# Altium project OBCv1.5.PrjPcb (part 2 of 2)

## Sheet POWER_SUPPLY.SchDoc
size 393 x 294 mm; SheetNumber: 4; SheetTotal: 7
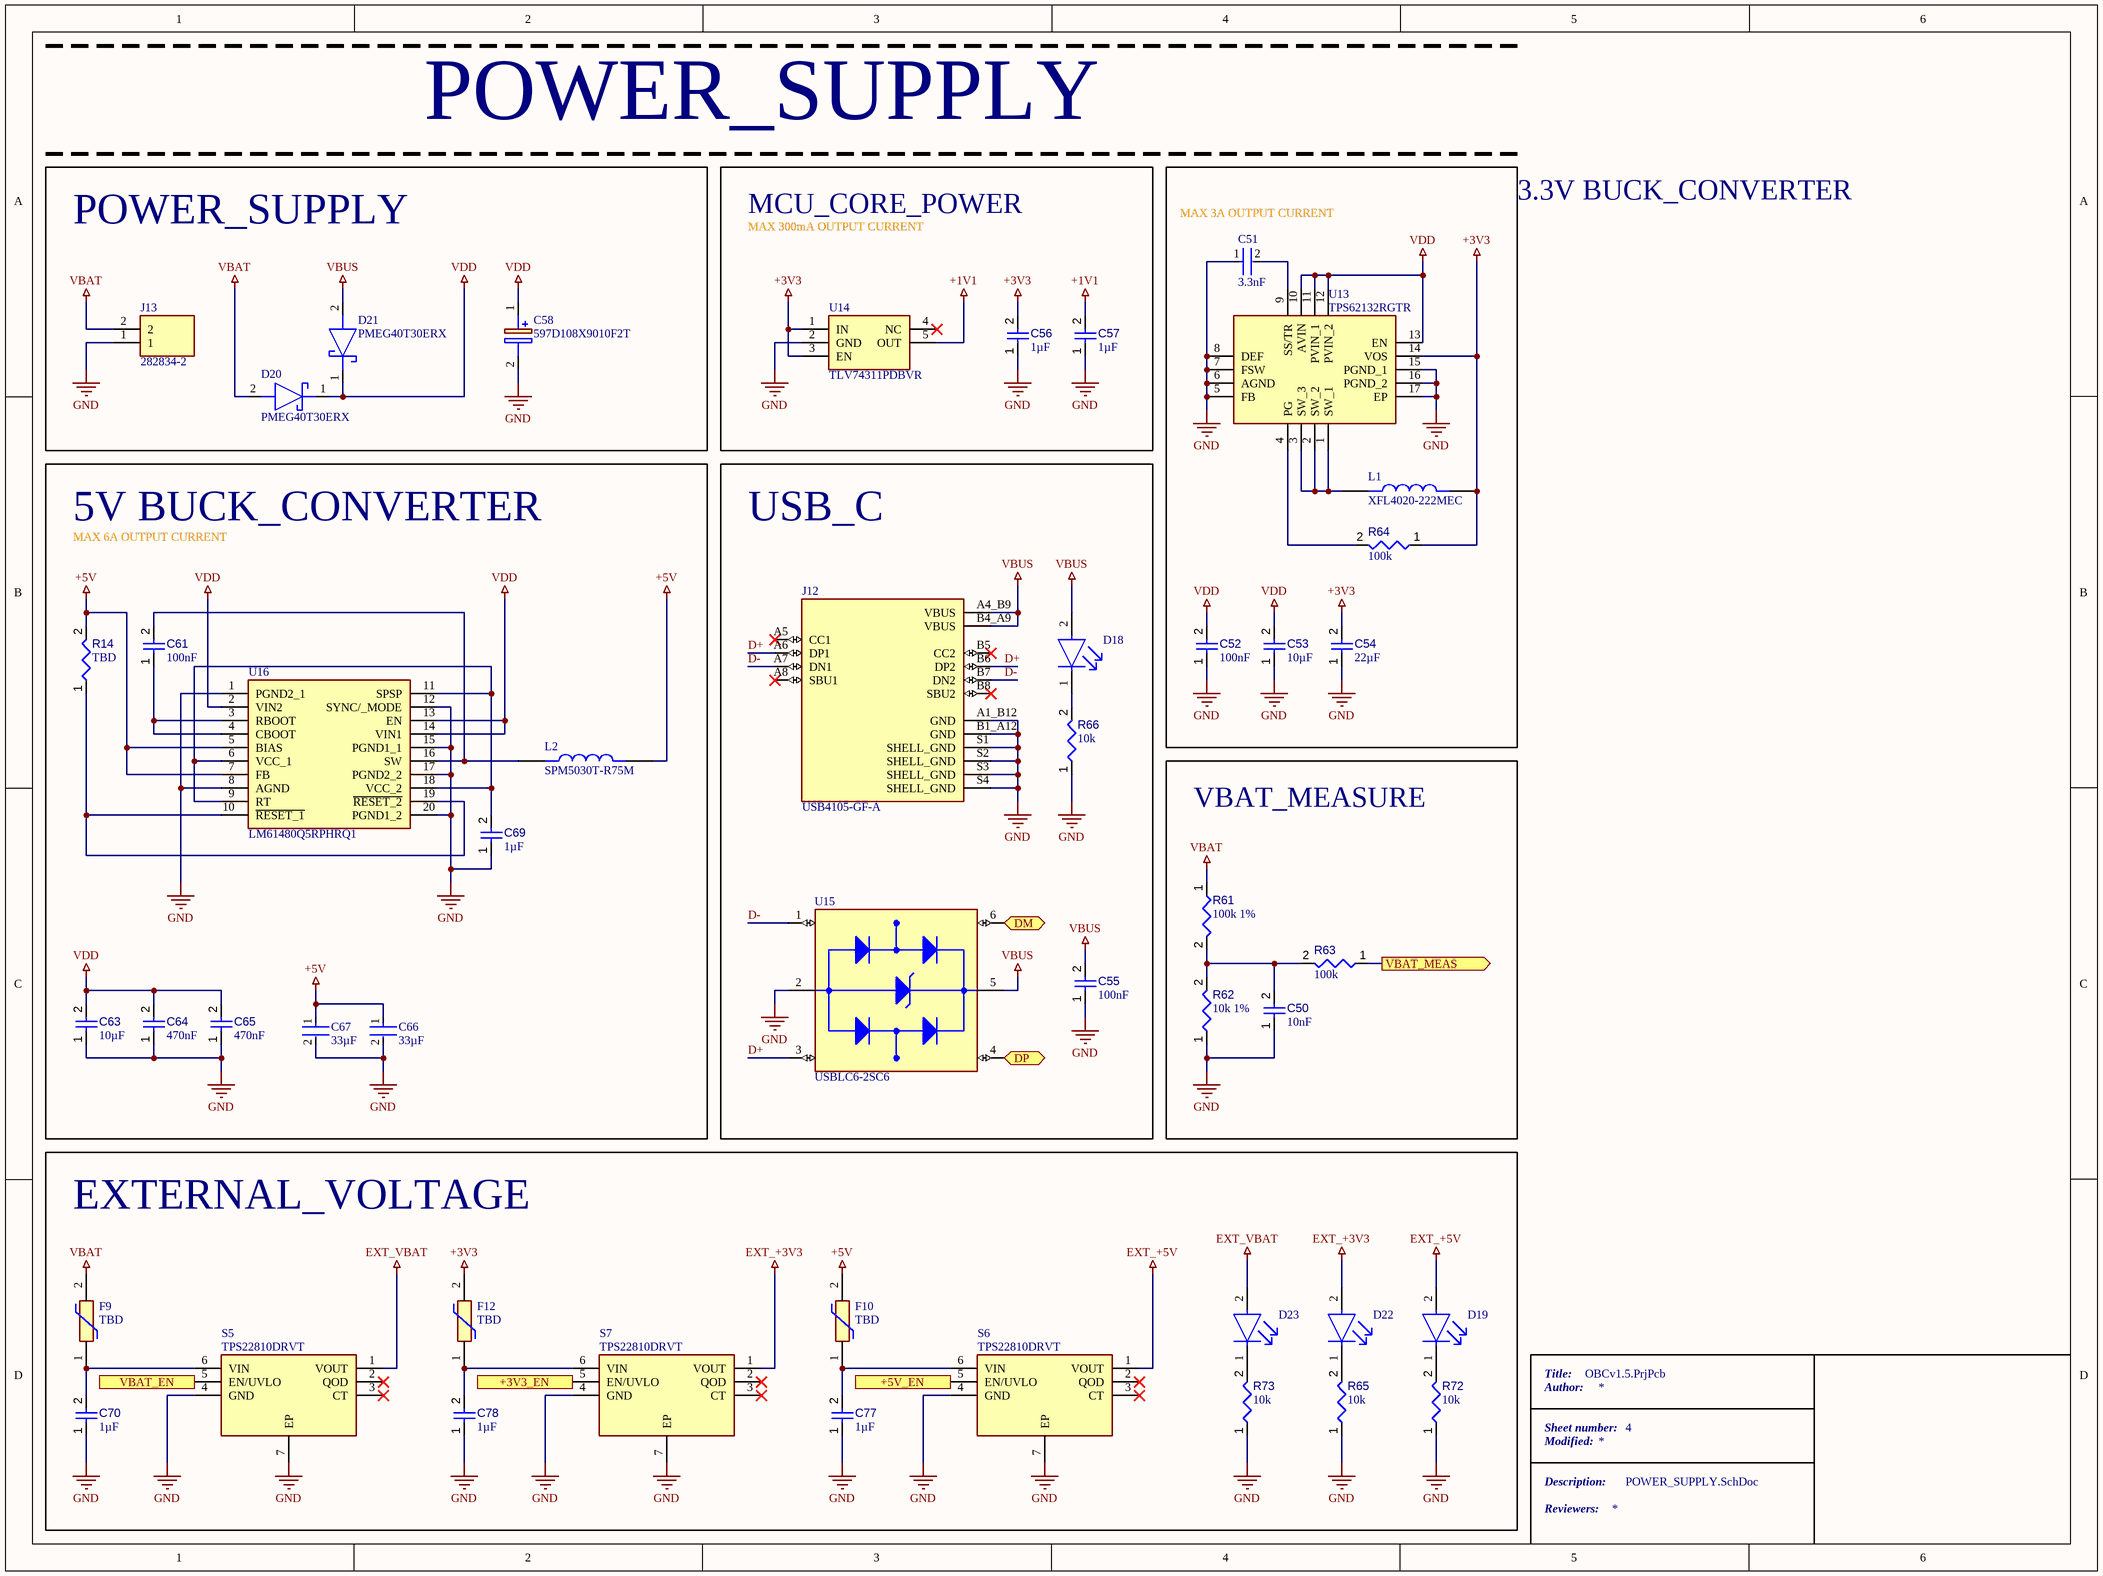
[diagram p5: POWER_SUPPLY.SchDoc]

### Parts
C50  value 10nF  [CAPC0402(1005)60_L]  (hidden comment: Capacitor 10nF +/-20% 50V 0402)
C51  3.3nF  [FP-CL388-IPC_C]
C52  value 100nF  [CAPC0402(1005)60_L]  (hidden comment: Capacitor 100nF +/-20% 10V 0402)
C53  value 10µF  [CAPC0603(1608)100_L]  (hidden comment: Capacitor 10µF +/-20% 10V 0603)
C54  value 22µF  [CAPC0805(2012)145_L]  (hidden comment: Capacitor 22µF +/-40% 16V 0805)
C55  value 100nF  [CAPC0402(1005)60_L]  (hidden comment: Capacitor 100nF +/-20% 10V 0402)
C56  value 1µF  [CAPC0402(1005)60_L]  (hidden comment: Capacitor 1µF +/-20% 10V 0402)
C57  value 1µF  [CAPC0402(1005)60_L]  (hidden comment: Capacitor 1µF +/-20% 10V 0402)
C58  597D108X9010F2T  [CAPPC5760X510N]
C61  value 100nF  [CAPC0402(1005)60_L]  (hidden comment: Capacitor 100nF +/-20% 10V 0402)
C63  value 10µF  [CAPC0603(1608)100_L]  (hidden comment: Capacitor 10µF +/-20% 10V 0603)
C64  value 470nF  [CAPC0402(1005)60_L]  (hidden comment: Capacitor 470nF +/-40% 10V 0402)
C65  value 470nF  [CAPC0402(1005)60_L]  (hidden comment: Capacitor 470nF +/-40% 10V 0402)
C66  33µF  [FP-C2012-125-0_2-IPC_A]
C67  33µF  [FP-C2012-125-0_2-IPC_A]
C69  value 1µF  [CAPC0402(1005)60_L]  (hidden comment: Capacitor 1µF +/-20% 10V 0402)
C70  value 1µF  [CAPC0402(1005)60_L]  (hidden comment: Capacitor 1µF +/-20% 10V 0402)
C77  value 1µF  [CAPC0402(1005)60_L]  (hidden comment: Capacitor 1µF +/-20% 10V 0402)
C78  value 1µF  [CAPC0402(1005)60_L]  (hidden comment: Capacitor 1µF +/-20% 10V 0402)
D18  (no value)  [FP-LTST-C191TBKT-MFG]
D19  (no value)  [FP-LTST-C191TBKT-MFG]
D20  PMEG40T30ERX  [SODFL3517X110N]
D21  PMEG40T30ERX  [SODFL3517X110N]
D22  (no value)  [FP-LTST-C191TBKT-MFG]
D23  (no value)  [FP-LTST-C191TBKT-MFG]
F9  TBD  [0402L010SLKR]
F10  TBD  [0402L010SLKR]
F12  TBD  [0402L010SLKR]
J12  USB4105-GF-A  [GCT_USB4105-GF-A]
J13  282834-2  [282834-2_1]
L1  XFL4020-222MEC  [IND_XFL4020-102MEC]
L2  SPM5030T-R75M  [IND_SPM5030T-R75M]
R14  TBD  [RESC0402(1005)_L]
R61  value 100k 1%  [RESC0402(1005)_L]  (hidden comment: Resistor 100K +/-1 % 0402 63 mW)
R62  value 10k 1%  [RESC0402(1005)_L]  (hidden comment: Resistor 10K  +/-1 % 0402 63 mW)
R63  value 100k  [RESC0402(1005)_L]  (hidden comment: Resistor 100K +/-1 % 0402 63 mW)
R64  value 100k  [RESC0402(1005)_L]  (hidden comment: Resistor 100K +/-1 % 0402 63 mW)
R65  value 10k  [RESC0402(1005)_L]  (hidden comment: Resistor 10K  +/-1 % 0402 63 mW)
R66  value 10k  [RESC0402(1005)_L]  (hidden comment: Resistor 10K  +/-1 % 0402 63 mW)
R72  value 10k  [RESC0402(1005)_L]  (hidden comment: Resistor 10K  +/-1 % 0402 63 mW)
R73  value 10k  [RESC0402(1005)_L]  (hidden comment: Resistor 10K  +/-1 % 0402 63 mW)
S5  TPS22810DRVT  [SON65P200X200X80-7N]
S6  TPS22810DRVT  [SON65P200X200X80-7N]
S7  TPS22810DRVT  [SON65P200X200X80-7N]
U13  TPS62132RGTR  [QFN50P300X300X100-17N-D]
U14  TLV74311PDBVR  [SOT95P280X145-5N]
U15  USBLC6-2SC6  [SOT95P280X145-6N]
U16  LM61480Q5RPHRQ1  [LM61480Q4RPHRQ1]

### Blocks framed on the sheet
POWER_SUPPLY: C58 D20 D21 J13
MCU_CORE_POWER: C56 C57 U14
MAX 3A OUTPUT CURRENT: C51-C54 L1 R64 U13
5V BUCK_CONVERTER: C61 C63-C67 C69 L2 R14 U16
USB_C: C55 D18 J12 R66 U15
VBAT_MEASURE: C50 R61-R63
EXTERNAL_VOLTAGE: C70 C77 C78 D19 D22 D23 F9 F10 F12 R65 R72 R73 S5-S7

### Ports
+3V3_EN (in, see MAIN_BOARD[2C], MCU[3B]), +5V_EN (in, see MAIN_BOARD[2C], MCU[3B]), DM (bidir, see MAIN_BOARD[2C], MCU[2A]), DP (bidir, see MAIN_BOARD[2C], MCU[2A]), VBAT_EN (in, see MAIN_BOARD[2C], MCU[3B]), VBAT_MEAS (out, see MAIN_BOARD[2C], MCU[3B])

### Nets
+1V1: C57.2 U14.5(OUT)
+3V3: C54.2 C56.2 F12.2 L1.1 R64.1 U13.14(VOS) U14.1(IN) U14.3(EN)
+5V: C66.1 C67.1 F10.2 L2.2 R14.2 U16.5(BIAS) U16.7(FB)
EXT_+3V3: D22.2(A) S7.1(VOUT)
EXT_+5V: D19.2(A) S6.1(VOUT)
EXT_VBAT: D23.2(A) S5.1(VOUT)
GND: C50.1 C51.1 C52.1 C53.1 C54.1 C55.1 C56.1 C57.1 C58.2(-) C63.1 C64.1 C65.1 C66.2 C67.2 C69.1 C70.1 C77.1 C78.1 J12.A1_B12(GND) J12.B1_A12(GND) J12.S1(SHELL_GND) J12.S2(SHELL_GND) J12.S3(SHELL_GND) J12.S4(SHELL_GND) J13.1 R62.1 R65.1 R66.1 R72.1 R73.1 S5.4(GND) S5.7(EP) S6.4(GND) S6.7(EP) S7.4(GND) S7.7(EP) U13.5(FB) U13.6(AGND) U13.7(FSW) U13.8(DEF) U13.15(PGND_1) U13.16(PGND_2) U13.17(EP) U14.2(GND) U15.2(GND) U16.1(PGND2_1) U16.8(AGND) U16.12(SYNC/_MODE) U16.15(PGND1_1) U16.17(PGND2_2) U16.20(PGND1_2)
VBAT: D20.2(A) F9.2 J13.2 R61.1
VBUS: C55.2 D18.2(A) D21.2(A) J12.A4_B9(VBUS) J12.B4_A9(VBUS) U15.5(VBUS)
VDD: C52.2 C53.2 C58.1(+) C63.2 C64.2 C65.2 D20.1(K) D21.1(K) U13.10(AVIN) U13.11(PVIN_1) U13.12(PVIN_2) U13.13(EN) U16.2(VIN2) U16.13(EN) U16.14(VIN1)
D+: J12.A6(DP1) J12.B6(DP2) U15.3(I/O2_IN)
D-: J12.A7(DN1) J12.B7(DN2) U15.1(I/O1_IN)
GPIO26: R63.1 ; port VBAT_MEAS
GPIO27: S7.5(EN/UVLO) ; port +3V3_EN
GPIO28: S6.5(EN/UVLO) ; port +5V_EN
GPIO29: S5.5(EN/UVLO) ; port VBAT_EN
NetC50_2: C50.2 R61.2 R62.2 R63.2
NetC51_2: C51.2 U13.9(SS/TR)
NetC61_1: C61.1 U16.3(RBOOT) U16.4(CBOOT)
NetC61_2: C61.2 L2.1 U16.16(SW)
NetC69_2: C69.2 U16.6(VCC_1) U16.9(RT) U16.11(SPSP) U16.18(VCC_2)
NetC70_2: C70.2 F9.1 S5.6(VIN)
NetC77_2: C77.2 F10.1 S6.6(VIN)
NetC78_2: C78.2 F12.1 S7.6(VIN)
NetD18_1: D18.1(C) R66.2
NetD19_1: D19.1(C) R72.2
NetD22_1: D22.1(C) R65.2
NetD23_1: D23.1(C) R73.2
NetL1_2: L1.2 U13.1(SW_1) U13.2(SW_2) U13.3(SW_3)
NetR1_2: U15.4(I/O2_OUT) ; port DP
NetR2_2: U15.6(I/O1_OUT) ; port DM
NetR14_1: R14.1 U16.10(~{RESET_1}) U16.19(~{RESET_2})
NetR64_2: R64.2 U13.4(PG)

Not connected (* = marked no-connect by the designer): J12 A5(CC1)* A8(SBU1)* B5(CC2)* B8(SBU2)*; S5 2(QOD)* 3(CT)*; S6 2(QOD)* 3(CT)*; S7 2(QOD)* 3(CT)*; U14 4(NC)*

### Notes on the sheet
- POWER_SUPPLY
- MAX 300mA OUTPUT CURRENT
- 3.3V BUCK_CONVERTER
- MAX 6A OUTPUT CURRENT
- Title:
- Author:
- Sheet number:
- Modified:
- Description:
- Reviewers:

### Library data of the parts
C50 = CMP-001-00069-3: Chip Capacitor, 10nF +/-20%, 50V, 0402, Thickness 0.6 mm; Tolerance: 5%; Max Operating Temperature: 85°C; Pins: 2; Case/Package: 0402; Voltage Rating: 50V; Min Operating Temperature: -55°C; Mounting Technology: SMT
C51 = CMP-13271-000627-1: Cap Ceramic 3.3nF 50V X7R ±10% SMD 0402 +125°C Paper T/R; Voltage Rating: 50V; Packaging: Tape and Reel; Mount: Surface Mount; Height: 0.5mm; Dielectric: X7R; Depth: 0.5mm; Tolerance: 10%; Voltage Rating (DC): 50V; Lead Free: Lead Free; Radiation Hardening: No; Thickness: 0.022inch; Case/Package: 0402; Width: 0.02inch; Contact Plating: Tin; Max Operating Temperature: 125°C; Length: 1mm; Case Code (Imperial): 0402; Capacitance: 3.3nF; Voltage: 50V; Case Code (Metric): 1005; Min Operating Temperature: -55°C; Package Quantity: 1; Material: Ceramic
C52 C55 C61 = CMP-001-00061-3: Chip Capacitor, 100nF +/-20%, 10V, 0402, Thickness 0.6 mm; Tolerance: 20%; Mounting Technology: SMT; Voltage Rating: 10V; Max Operating Temperature: 85°C; Pins: 2; Case/Package: 0402; Min Operating Temperature: -55°C
C53 C63 = CMP-001-00075-4: Chip Capacitor, 10µF +/-20%, 10V, 0603, Thickness 1 mm; Tolerance: 10%; Voltage Rating: 10V; Max Operating Temperature: 85°C; Pins: 2; Case/Package: 0603; Mounting Technology: SMT; Min Operating Temperature: -55°C
C54 = CMP-001-00081-4: Chip Capacitor, 22µF +/-40%, 16V, 0805, Thickness 1.45 mm; Tolerance: 5%; Voltage Rating: 16V; Mounting Technology: SMT; Pins: 2; Max Operating Temperature: 85°C; Case/Package: 0805; Min Operating Temperature: -55°C
C56 C57 C69 C70 C77 C78 = CMP-001-00063-3: Chip Capacitor, 1µF +/-20%, 10V, 0402, Thickness 0.6 mm; Tolerance: 10%; Mounting Technology: SMT; Max Operating Temperature: 85°C; Voltage Rating: 10V; Pins: 2; Case/Package: 0402; Min Operating Temperature: -55°C
C58 = 597D108X9010F2T: Capacitor Polarised; Manufacturer_Name: Vishay; Datasheet Link: http://www.vishay.com/doc?40047; Height: 5.1mm; Manufacturer_Part_Number: 597D108X9010F2T; Mouser Part Number: 71-597D108X9010F2T; Mouser Price/Stock: https://www.mouser.co.uk/ProductDetail/Vishay-Sprague/597D108X9010F2T?qs=IbgLjqUpHQCfIl1FLFnbYA%3D%3D; Arrow Part Number: 597D108X9010F2T; Arrow Price/Stock: https://www.arrow.com/en/products/597d108x9010f2t/vishay?region=nac
C64 C65 = CMP-001-00060-4: Chip Capacitor, 470nF +/-40%, 10V, 0402, Thickness 0.6 mm; Tolerance: 20%; Max Operating Temperature: 85°C; Case/Package: 0402; Voltage Rating: 10V; Min Operating Temperature: -55°C; Mounting Technology: SMT; Pins: 2
C66 C67 = CMP-08246-003796-1: Multilayer Ceramic Capacitors 33μF ±20% 6.3V X5R SMD 0805; Capacitance: 33uF; Series: C; Min Operating Temperature: -55°C; Depth: 1.25mm; Radiation Hardening: No; Package Quantity: 1; Height: 1.25mm; Max Operating Temperature: 85°C; REACH SVHC: No SVHC; Mount: Surface Mount; Construction: Flat; Case/Package: 0805; Dielectric Material: Ceramic; Thickness: 0.057inch; Case Code (Imperial): 0805; Lead Free: Lead Free; Weight: 0.000194oz; Case Code (Metric): 2012; Tolerance: 20%; Dielectric: X5R; RoHS Compliant: Yes; Length: 2mm; Packaging: Tape and Reel; Voltage Rating (DC): 6.3V; Width: 1.2mm; Resistor Type: Ceramic; Termination: SMD/SMT; Voltage Rating: 6.3V
D18 D19 D22 D23 = CMP-22017-000008-1: LED BLUE CLEAR CHIP SMD; Lens Color: Colorless; Dominant Wavelength: 475nm; Forward Current: 20mA; Wavelength: 468nm; Viewing Angle: 130°; Power Dissipation: 76mW; Luminous Intensity: 180mcd; Reverse Voltage: 5V; Number of Elements: 1; Lens Style: Diffused; Forward Voltage: 3.8V; Max Power Dissipation: 75mW; Case Code (Metric): 1608; Packaging: Tape and Reel; Case/Package: 0603; Depth: 1.6mm; Mount: Surface Mount; Lead Free: Lead Free; Min Operating Temperature: -20°C; Lens Transparency: Clear; Illumination Color: Blue; Height: 0.55mm; Test Current: 20mA; Case Code (Imperial): 0603; Max Operating Temperature: 80°C; Number of Pins: 2; Length: 0.8mm; Radiation Hardening: No; Package Quantity: 1; Number of LEDs: 1; Width: 0.8mm; Color: Blue
D20 D21 = PMEG60T30ELRX: Schottky Diode; Manufacturer_Name: Nexperia; Datasheet Link: https://assets.nexperia.com/documents/data-sheet/PMEG60T30ELR.pdf; Height: 1.1mm; Manufacturer_Part_Number: PMEG60T30ELRX; Mouser Part Number: 771-PMEG60T30ELRX; Mouser Price/Stock: https://www.mouser.co.uk/ProductDetail/Nexperia/PMEG60T30ELRX?qs=MLItCLRbWswWnbT%2FWpJcxg%3D%3D; Arrow Part Number: PMEG60T30ELRX; Arrow Price/Stock: https://www.arrow.com/en/products/pmeg60t30elrx/nexperia?region=nac
F9 F10 F12 = 0402L100SLKR: Resettable Fuse; Manufacturer_Name: LITTELFUSE; Datasheet Link: https://g.componentsearchengine.com/Datasheets/1/0402L010SLKR.pdf; Height: 0.6mm; Manufacturer_Part_Number: 0402L100SLKR; Mouser Part Number: 576-0402L100SLKR; Mouser Price/Stock: https://www.mouser.co.uk/ProductDetail/Littelfuse/0402L100SLKR?qs=7MVldsJ5Uay4EIwecFafFg%3D%3D
J12 = USB4105-GF-A: USB-C (USB TYPE-C) USB 2.0 Receptacle Connector 24 (16+8 Dummy) Position Surface Mount, Right Angle; Through Hole; MF: {'manufacturer': u'GCT'}; Package: None; Price: None; Value: *; MP: USB4105-GF-A; Availability: Unavailable
J13 = 282834-2: Connector; Manufacturer_Name: TE Connectivity; Datasheet Link: https://www.te.com/commerce/DocumentDelivery/DDEController?Action=srchrtrv&DocNm=1-1773458-1_EURO_STYLE_QRG&DocType=Data+Sheet&DocLang=English&PartCntxt=282834-2&DocFormat=pdf; Manufacturer_Part_Number: 282834-2; Mouser Part Number: 571-282834-2; Mouser Price/Stock: https://www.mouser.co.uk/ProductDetail/TE-Connectivity/282834-2?qs=A%252Bip%252BNCYi6N8cVKuk8xDog%3D%3D; Arrow Part Number: 282834-2; Arrow Price/Stock: https://www.arrow.com/en/products/282834-2/te-connectivity?region=europe
L1 = XFL4020-102MEC: Power inductor, shielded, 20% tol, SMT, RoHS, halogen free; MF: {'manufacturer': u'Coilcraft'}; Package: None; Price: None; Value: *; MP: XFL4020-102MEC; Availability: Unavailable
L2 = SPM5030T-R75M: MF: {'manufacturer': u'TDK'}; Package: None; Price: None; Value: *; MP: SPM5030T-R75M; Availability: Unavailable
R14 = CMP-009-00168-3: Tolerance: 1%; Power: 63mW; Max Operating Temperature: 155°C; Min Operating Temperature: -55°C; Pins: 2; Case/Package: 0402; Value: TBD
R61 R63 R64 = CMP-009-00168-3: Chip Resistor, 100 kOhms, +/-1 %, 63 mW, -55 to 155 degC, 0402; Tolerance: 1%; Power: 63mW; Max Operating Temperature: 155°C; Min Operating Temperature: -55°C; Pins: 2; Case/Package: 0402
R62 R65 R66 R72 R73 = CMP-009-00149-3: Chip Resistor, 10 kOhms, +/-1 %, 63 mW, -55 to 125 degC, 0402; Power: 63mW; Tolerance: 1%; Min Operating Temperature: -55°C; Case/Package: 0402; Max Operating Temperature: 155°C; Pins: 2
S5-S7 = TPS22810DRVT: Switch; Manufacturer_Name: Texas Instruments; Datasheet Link: http://www.ti.com/general/docs/lit/getliterature.tsp?genericPartNumber=TPS22810&fileType=pdf; Height: 0.8mm; Manufacturer_Part_Number: TPS22810DRVT; Mouser Part Number: 595-TPS22810DRVT; Mouser Price/Stock: https://www.mouser.co.uk/ProductDetail/Texas-Instruments/TPS22810DRVT?qs=5aG0NVq1C4wtEcND0E9Qlg%3D%3D; Arrow Part Number: TPS22810DRVT; Arrow Price/Stock: https://www.arrow.com/en/products/tps22810drvt/texas-instruments?region=nac
U13 = TPS62132RGTR: Integrated Circuit; Manufacturer_Name: Texas Instruments; Datasheet Link: http://www.ti.com/lit/gpn/tps62132; Height: 1mm; Manufacturer_Part_Number: TPS62132RGTR; Mouser Part Number: 595-TPS62132RGTR; Mouser Price/Stock: https://www.mouser.co.uk/ProductDetail/Texas-Instruments/TPS62132RGTR?qs=gXEV9p%2FxLgdM8Qvmd5pchA%3D%3D; Arrow Part Number: TPS62132RGTR; Arrow Price/Stock: https://www.arrow.com/en/products/tps62132rgtr/texas-instruments
U14 = TLV70311DBVR: Integrated Circuit; Manufacturer_Name: Texas Instruments; Datasheet Link: http://www.ti.com/lit/gpn/tlv703; Height: 1.45mm; Manufacturer_Part_Number: TLV70311DBVR; Mouser Part Number: 595-TLV70311DBVR; Mouser Price/Stock: https://www.mouser.co.uk/ProductDetail/Texas-Instruments/TLV70311DBVR?qs=YCa%2FAAYMW01QIBcdppGpKA%3D%3D; Arrow Part Number: TLV70311DBVR; Arrow Price/Stock: https://www.arrow.com/en/products/tlv70311dbvr/texas-instruments
U15 = USBLC6-2SC6: <a href="https://pricing.snapeda.com/parts/USBLC6-2SC6/STMicroelectronics/view-part?ref=eda">Check availability</a>  <a href="https://pricing.snapeda.com/parts/USBLC6-2SC6/STMicroelectronics/view-part?ref=eda">Check availability</a>; MF: {'manufacturer': u'STMicroelectronics'}; Package: None; MP: USBLC6-2SC6; Value: *; Price: None; Availability: Unavailable
U16 = LM61480Q5RPHRQ1: Integrated Circuit; Manufacturer_Name: Texas Instruments; Datasheet Link: https://www.ti.com/lit/ds/symlink/lm62460-q1.pdf?HQS=dis-mous-null-mousermode-dsf-pf-null-wwe&ts=1692068705145&ref_url=https%253A%252F%252Fth.mouser.com%252F; Height: 1mm; Manufacturer_Part_Number: LM61480Q5RPHRQ1; Mouser Part Number: 595-LM61480Q5RPHRQ1; Mouser Price/Stock: https://www.mouser.co.uk/ProductDetail/Texas-Instruments/LM61480Q5RPHRQ1?qs=Wj%2FVkw3K%252BMDu%252B1Udc40Oyw%3D%3D; Arrow Part Number: LM61480Q5RPHRQ1; Arrow Price/Stock: https://www.arrow.com/en/products/lm61480q5rphrq1/texas-instruments?region=nac

## Sheet SERVOS.SchDoc
size 271 x 281 mm; SheetNumber: 7; SheetTotal: 7
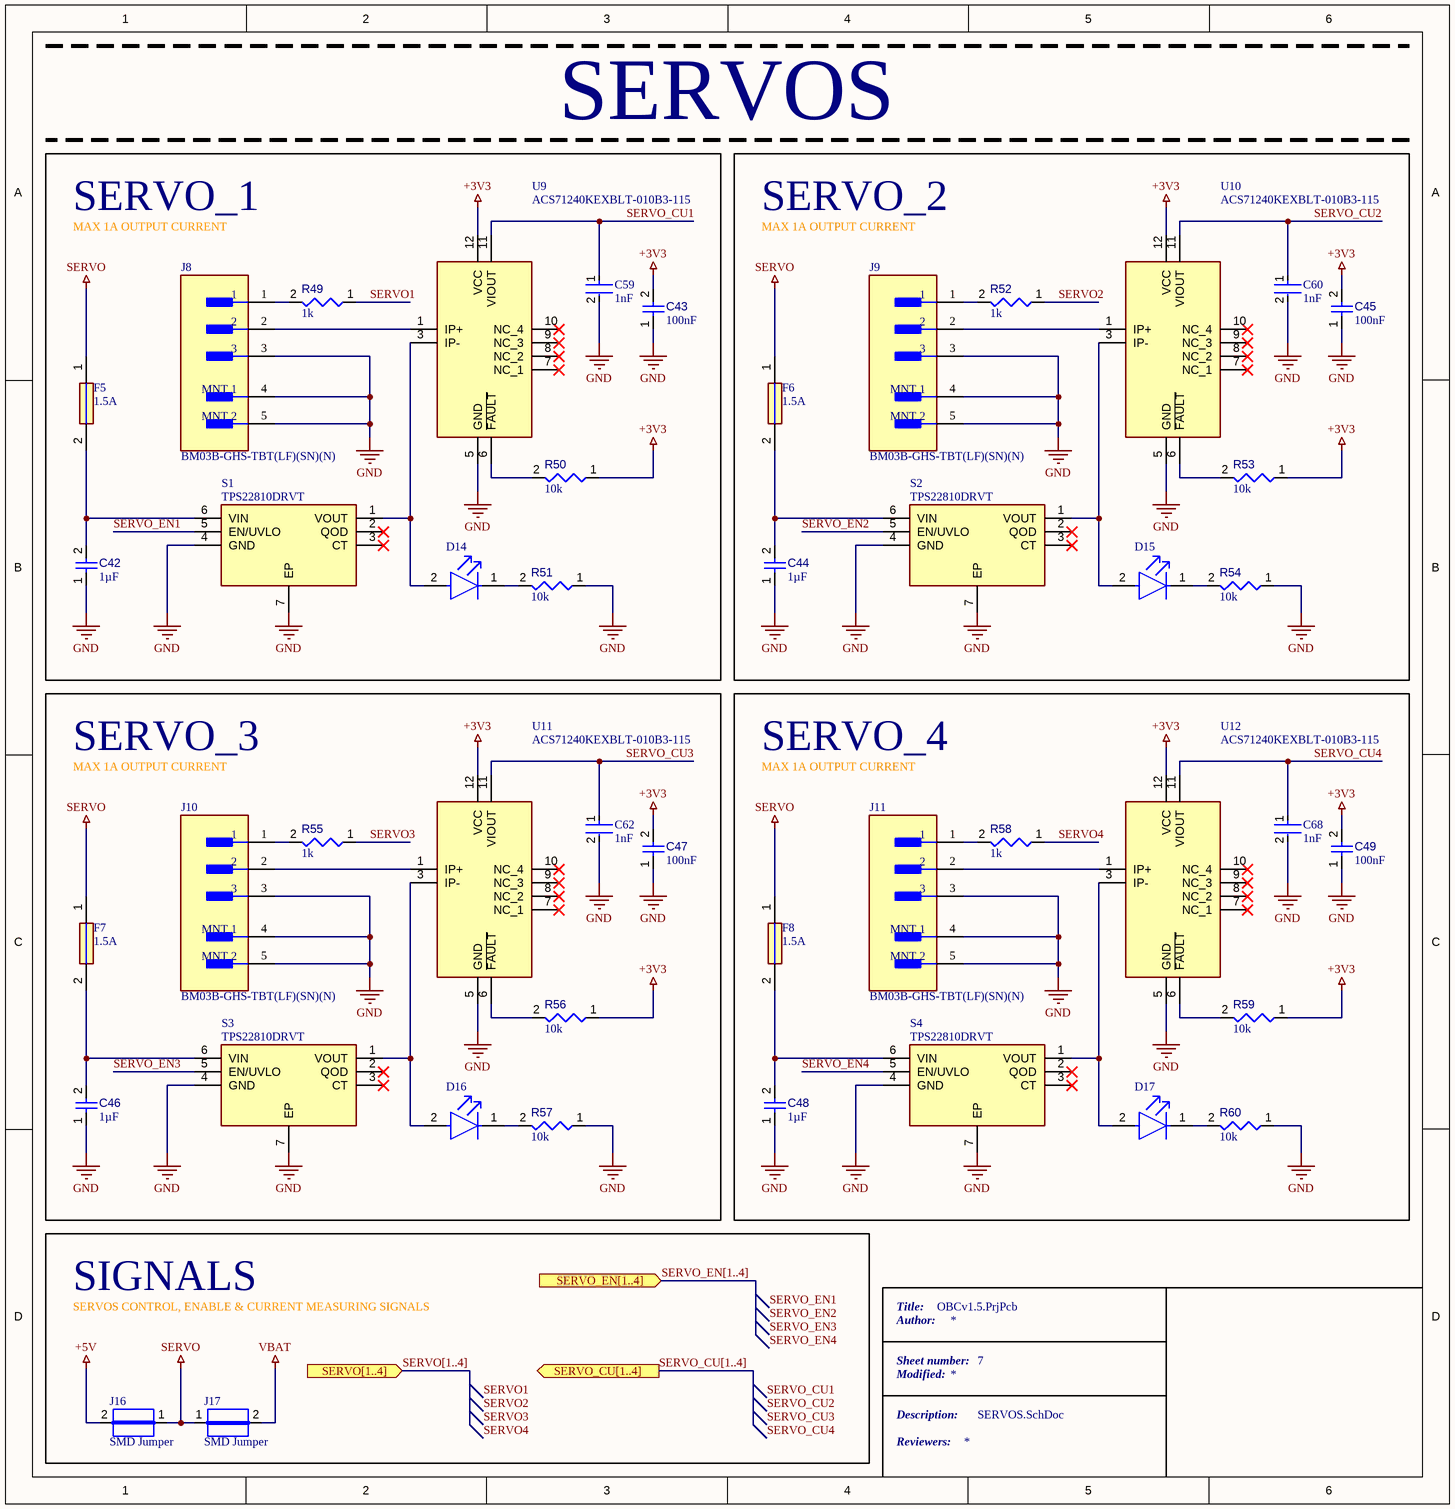
[diagram p6: SERVOS.SchDoc]

### Parts
C42  value 1µF  [CAPC0402(1005)60_L]  (hidden comment: Capacitor 1µF +/-20% 10V 0402)
C43  value 100nF  [CAPC0402(1005)60_L]  (hidden comment: Capacitor 100nF +/-20% 10V 0402)
C44  value 1µF  [CAPC0402(1005)60_L]  (hidden comment: Capacitor 1µF +/-20% 10V 0402)
C45  value 100nF  [CAPC0402(1005)60_L]  (hidden comment: Capacitor 100nF +/-20% 10V 0402)
C46  value 1µF  [CAPC0402(1005)60_L]  (hidden comment: Capacitor 1µF +/-20% 10V 0402)
C47  value 100nF  [CAPC0402(1005)60_L]  (hidden comment: Capacitor 100nF +/-20% 10V 0402)
C48  value 1µF  [CAPC0402(1005)60_L]  (hidden comment: Capacitor 1µF +/-20% 10V 0402)
C49  value 100nF  [CAPC0402(1005)60_L]  (hidden comment: Capacitor 100nF +/-20% 10V 0402)
C59  1nF  [FP-GRM155-0_05-IPC_B]
C60  1nF  [FP-GRM155-0_05-IPC_B]
C62  1nF  [FP-GRM155-0_05-IPC_B]
C68  1nF  [FP-GRM155-0_05-IPC_B]
D14  (no value)  [FP-LTST-C191TBKT-MFG]
D15  (no value)  [FP-LTST-C191TBKT-MFG]
D16  (no value)  [FP-LTST-C191TBKT-MFG]
D17  (no value)  [FP-LTST-C191TBKT-MFG]
F5  1.5A  [FUSC2516X100N]
F6  1.5A  [FUSC2516X100N]
F7  1.5A  [FUSC2516X100N]
F8  1.5A  [FUSC2516X100N]
J8  BM03B-GHS-TBT(LF)(SN)(N)  [FP-BM03B-GHS-TBT_LF_SN-MFG]
J9  BM03B-GHS-TBT(LF)(SN)(N)  [FP-BM03B-GHS-TBT_LF_SN-MFG]
J10  BM03B-GHS-TBT(LF)(SN)(N)  [FP-BM03B-GHS-TBT_LF_SN-MFG]
J11  BM03B-GHS-TBT(LF)(SN)(N)  [FP-BM03B-GHS-TBT_LF_SN-MFG]
J16  SMD Jumper  [RESC3225X06N]
J17  SMD Jumper  [RESC3225X06N]
R49  value 1k  [RESC0402(1005)_L]  (hidden comment: Resistor 1K +/-5 % 0402 63 mW)
R50  value 10k  [RESC0402(1005)_L]  (hidden comment: Resistor 10K  +/-1 % 0402 63 mW)
R51  value 10k  [RESC0402(1005)_L]  (hidden comment: Resistor 10K  +/-1 % 0402 63 mW)
R52  value 1k  [RESC0402(1005)_L]  (hidden comment: Resistor 1K +/-5 % 0402 63 mW)
R53  value 10k  [RESC0402(1005)_L]  (hidden comment: Resistor 10K  +/-1 % 0402 63 mW)
R54  value 10k  [RESC0402(1005)_L]  (hidden comment: Resistor 10K  +/-1 % 0402 63 mW)
R55  value 1k  [RESC0402(1005)_L]  (hidden comment: Resistor 1K +/-5 % 0402 63 mW)
R56  value 10k  [RESC0402(1005)_L]  (hidden comment: Resistor 10K  +/-1 % 0402 63 mW)
R57  value 10k  [RESC0402(1005)_L]  (hidden comment: Resistor 10K  +/-1 % 0402 63 mW)
R58  value 1k  [RESC0402(1005)_L]  (hidden comment: Resistor 1K +/-5 % 0402 63 mW)
R59  value 10k  [RESC0402(1005)_L]  (hidden comment: Resistor 10K  +/-1 % 0402 63 mW)
R60  value 10k  [RESC0402(1005)_L]  (hidden comment: Resistor 10K  +/-1 % 0402 63 mW)
S1  TPS22810DRVT  [SON65P200X200X80-7N]
S2  TPS22810DRVT  [SON65P200X200X80-7N]
S3  TPS22810DRVT  [SON65P200X200X80-7N]
S4  TPS22810DRVT  [SON65P200X200X80-7N]
U9  ACS71240KEXBLT-010B3-115  [ACS71240KEXBLT010B3115]
U10  ACS71240KEXBLT-010B3-115  [ACS71240KEXBLT010B3115]
U11  ACS71240KEXBLT-010B3-115  [ACS71240KEXBLT010B3115]
U12  ACS71240KEXBLT-010B3-115  [ACS71240KEXBLT010B3115]

### Blocks framed on the sheet
SERVOS: C42 C43 C59 D14 F5 J8 R49-R51 S1 U9
SERVO_2: C44 C45 C60 D15 F6 J9 R52-R54 S2 U10
SERVO_3: C46 C47 C62 D16 F7 J10 R55-R57 S3 U11
SERVO_4: C48 C49 C68 D17 F8 J11 R58-R60 S4 U12
SIGNALS: J16 J17

### Ports
SERVO[1..4] (in, see MAIN_BOARD[3C], MCU[6A]), SERVO_CU[1..4] (out, see MAIN_BOARD[3C], MCU[6A]), SERVO_EN[1..4] (in, see MAIN_BOARD[3C], MCU[6B])

### Nets
+3V3: C43.2 C45.2 C47.2 C49.2 R50.1 R53.1 R56.1 R59.1 U9.12(VCC) U10.12(VCC) U11.12(VCC) U12.12(VCC)
+5V: J16.2
GND: C42.1 C43.1 C44.1 C45.1 C46.1 C47.1 C48.1 C49.1 C59.2 C60.2 C62.2 C68.2 J8.3 J8.4(MNT_1) J8.5(MNT_2) J9.3 J9.4(MNT_1) J9.5(MNT_2) J10.3 J10.4(MNT_1) J10.5(MNT_2) J11.3 J11.4(MNT_1) J11.5(MNT_2) R51.1 R54.1 R57.1 R60.1 S1.4(GND) S1.7(EP) S2.4(GND) S2.7(EP) S3.4(GND) S3.7(EP) S4.4(GND) S4.7(EP) U9.5(GND) U10.5(GND) U11.5(GND) U12.5(GND)
SERVO: F5.1 F6.1 F7.1 F8.1 J16.1 J17.1
VBAT: J17.2
SERVO1: R49.1  [project net GPIO25]
SERVO2: R52.1  [project net GPIO23]
SERVO3: R55.1  [project net GPIO15]
SERVO4: R58.1  [project net GPIO18]
SERVO_CU1: C59.1 U9.11(VIOUT)  [project net AIN7]
SERVO_CU2: C60.1 U10.11(VIOUT)  [project net AIN6]
SERVO_CU3: C62.1 U11.11(VIOUT)  [project net AIN0]
SERVO_CU4: C68.1 U12.11(VIOUT)  [project net AIN1]
SERVO_EN1: S1.5(EN/UVLO)  [project net GPIO24]
SERVO_EN2: S2.5(EN/UVLO)  [project net GPIO22]
SERVO_EN3: S3.5(EN/UVLO)  [project net GPIO20]
SERVO_EN4: S4.5(EN/UVLO)  [project net GPIO19]
NetC42_2: C42.2 F5.2 S1.6(VIN)
NetC44_2: C44.2 F6.2 S2.6(VIN)
NetC46_2: C46.2 F7.2 S3.6(VIN)
NetC48_2: C48.2 F8.2 S4.6(VIN)
NetD14_1: D14.1(C) R51.2
NetD14_2: D14.2(A) S1.1(VOUT) U9.3(IP-)
NetD15_1: D15.1(C) R54.2
NetD15_2: D15.2(A) S2.1(VOUT) U10.3(IP-)
NetD16_1: D16.1(C) R57.2
NetD16_2: D16.2(A) S3.1(VOUT) U11.3(IP-)
NetD17_1: D17.1(C) R60.2
NetD17_2: D17.2(A) S4.1(VOUT) U12.3(IP-)
NetJ8_1: J8.1 R49.2
NetJ8_2: J8.2 U9.1(IP+)
NetJ9_1: J9.1 R52.2
NetJ9_2: J9.2 U10.1(IP+)
NetJ10_1: J10.1 R55.2
NetJ10_2: J10.2 U11.1(IP+)
NetJ11_1: J11.1 R58.2
NetJ11_2: J11.2 U12.1(IP+)
NetR50_2: R50.2 U9.6(~{FAULT})
NetR53_2: R53.2 U10.6(~{FAULT})
NetR56_2: R56.2 U11.6(~{FAULT})
NetR59_2: R59.2 U12.6(~{FAULT})

Not connected (* = marked no-connect by the designer): S1 2(QOD)* 3(CT)*; S2 2(QOD)* 3(CT)*; S3 2(QOD)* 3(CT)*; S4 2(QOD)* 3(CT)*; U9 7(NC_1)* 8(NC_2)* 9(NC_3)* 10(NC_4)*; U10 7(NC_1)* 8(NC_2)* 9(NC_3)* 10(NC_4)*; U11 7(NC_1)* 8(NC_2)* 9(NC_3)* 10(NC_4)*; U12 7(NC_1)* 8(NC_2)* 9(NC_3)* 10(NC_4)*

### Buses and harness runs
bus SERVO[1..4] = port SERVO[1..4]
bus SERVO_CU[1..4] = port SERVO_CU[1..4]
bus SERVO_EN[1..4] = port SERVO_EN[1..4]

### Notes on the sheet
- SERVO_1
- MAX 1A OUTPUT CURRENT
- SERVOS CONTROL, ENABLE & CURRENT MEASURING SIGNALS
- Title:
- Author:
- Sheet number:
- Modified:
- Description:
- Reviewers:
- Labels drawn without touching a wire or pin: SERVO1, SERVO2, SERVO3, SERVO4, SERVO_CU1, SERVO_CU2, SERVO_CU3, SERVO_CU4, SERVO_EN1, SERVO_EN2, SERVO_EN3, SERVO_EN4
- THIS DOCUMENT AND THE DATA DISCLOSED HEREIN OR
- HEREWITH IS THE PROPERTY OF ALTIUM LIMITED AND MAY
- DWG NO:
- REVISION
- REV:
- DESCRIPTION
- DATE
- APPROVED
- BE FREELY DISTRIBUTED IN WHOLE. NO RIGHTS ARE
- RESERVED OR EXPRESS OR IMPLIED WARANTEE GIVEN.
- ENG:
- APPROVALS
- PROJECT
- DSN:
- CHK:
- REFERENCE DOCUMENTS
- PROJECT REVISION:
- TITLE
- DOCUMENT REVISION:
- DESIGN ITEM:
- BOM:
- FAB DWG:
- PCB DWG:
- ASSY DWG:
- SCALE:
- A3
- SIZE
- CAGE CODE
- FILE NAME
- DWG NO.
- SHEET
- OF
- REV

### Library data of the parts
C42 C44 C46 C48 = CMP-001-00063-3: as C56 on sheet POWER_SUPPLY; Mounting Technology: SMT; Max Operating Temperature: 85°C; Voltage Rating: 10V; Pins: 2; Case/Package: 0402; Min Operating Temperature: -55°C
C43 C45 C47 C49 = CMP-001-00061-3: as C52 on sheet POWER_SUPPLY; Mounting Technology: SMT; Voltage Rating: 10V; Max Operating Temperature: 85°C; Pins: 2; Case/Package: 0402; Min Operating Temperature: -55°C
C59 C60 C62 C68 = CMP-2008-04254-2: Chip Multilayer Ceramic Capacitors for General Purpose, 0402, 1000pF, C0G, 30ppm/°C, 5%, 50V; Insulation Resistance: 10GR; Packaging: Tape and Reel; Lead Free: Lead Free; Tolerance: 5%; Temperature Coefficient: 30ppm/°C; Thickness: 0.022inch; Termination: SMD/SMT; Max Operating Temperature: 125°C; Height: 0.5mm; Package Quantity: 1; Radiation Hardening: No; Material: Ceramic; Case Code (Metric): 1005; Number of Pins: 2; Voltage Rating: 50V; Mount: Surface Mount; Voltage: 50V; Case/Package: 0402; Min Operating Temperature: -55°C; Dielectric Material: Ceramic; Width: 0.5mm; Depth: 0.5mm; Case Code (Imperial): 0402; REACH SVHC: No SVHC; Dielectric: C0G; Capacitance: 1nF; Voltage Rating (DC): 50V; Length: 1mm
D14-D17 = CMP-22017-000008-1: as D18 on sheet POWER_SUPPLY; Case Code (Metric): 1608; Packaging: Tape and Reel; Case/Package: 0603; Depth: 1.6mm; Mount: Surface Mount; Lead Free: Lead Free; Min Operating Temperature: -20°C; Lens Transparency: Clear; Illumination Color: Blue; Height: 0.55mm; Test Current: 20mA; Case Code (Imperial): 0603; Max Operating Temperature: 80°C; Number of Pins: 2; Length: 0.8mm; Radiation Hardening: No; Package Quantity: 1; Number of LEDs: 1; Width: 0.8mm; Color: Blue
F5-F8 = PTSLR08058V300: Fuse; Manufacturer_Name: Eaton; Datasheet Link: https://gr.mouser.com/datasheet/2/87/eaton_ptslr0805_surface_mount_resettable_fuse_data-1839574.pdf; Height: 1mm; Manufacturer_Part_Number: PTSLR08058V300
J8-J11 = CMP-17439-000058-1: CONN HEADER SMD 3POS 1.25MM; Pitch: 0.049inch; Number of Positions: 3; Contact Finish - Mating: TIN; Lead Free: Lead Free; Series: GH; Fastening Type: Ramp; Number of Rows: 1; Insulation Color: Natural; Contact Material: Bronze; Insulation Material: Nylon; Min Operating Temperature: -25°C; Contact Type: Outer Shroud Contact; Max Operating Temperature: 85°C; Termination: Solder; Flammability Rating: UL94 V-0; Color: Natural; Contact Plating: Tin; Contact Shape: Rectangular; Mount: Surface Mount; Packaging: Cut Tape; Connector Type: Header
J16 J17 = CMP-00030-00001-2: SMD Jumper, size 1210 (imperial); Mounting Technology: SMD; RoHS Compliant: Yes; Case/Package: 1210 (imperial); Pins: 2; Max Operating Temperature: 1000°C; Min Operating Temperature: -1000°C
R49 R52 R55 R58 = CMP-009-00157-3: Chip Resistor, 1 kOhms, +/-5 %, 63 mW, -55 to 155 degC, 0402; Tolerance: 5%; Power: 63mW; Case/Package: 0402; Pins: 2; Min Operating Temperature: -55°C; Max Operating Temperature: 155°C
R50 R51 R53 R54 R56 R57 R59 R60 = CMP-009-00149-3: as R62 on sheet POWER_SUPPLY; Min Operating Temperature: -55°C; Case/Package: 0402; Max Operating Temperature: 155°C; Pins: 2
S1-S4 = TPS22810DRVT: as S5 on sheet POWER_SUPPLY; Datasheet Link: http://www.ti.com/general/docs/lit/getliterature.tsp?genericPartNumber=TPS22810&fileType=pdf; Height: 0.8mm; Manufacturer_Part_Number: TPS22810DRVT; Mouser Part Number: 595-TPS22810DRVT; Mouser Price/Stock: https://www.mouser.co.uk/ProductDetail/Texas-Instruments/TPS22810DRVT?qs=5aG0NVq1C4wtEcND0E9Qlg%3D%3D; Arrow Part Number: TPS22810DRVT; Arrow Price/Stock: https://www.arrow.com/en/products/tps22810drvt/texas-instruments?region=nac
U9-U12 = ACS71240KEXBLT-010B3-115: Integrated Circuit; Manufacturer_Name: Allegro Microsystems; Datasheet Link: https://www.allegromicro.com/-/media/files/datasheets/acs71240-datasheet.ashx; Height: 0.8mm; Manufacturer_Part_Number: ACS71240KEXBLT-010B3-115; Mouser Part Number: 250-71240KEXBL0B3115; Mouser Price/Stock: https://www.mouser.co.uk/ProductDetail/Allegro-MicroSystems/ACS71240KEXBLT-010B3-115?qs=pUKx8fyJudB4EfgYZFsj7A%3D%3D; Arrow Part Number: ACS71240KEXBLT-010B3-115; Arrow Price/Stock: https://www.arrow.com/en/products/acs71240kexblt-010b3-115/allegro-microsystems?region=nac

## Nets that join several sheets
+1V1: MCU (C10.2 C11.2 U1.23 U1.50), POWER_SUPPLY (C57.2 U14.5)
+3V3: MCU (26 pins), IO (18 pins), SENSORS (31 pins), POWER_SUPPLY (8 pins), SERVOS (12 pins)
+5V: POWER_SUPPLY (7 pins), SERVOS (J16.2)
GND: MCU (27 pins), IO (17 pins), SENSORS (46 pins), IGNITERS (20 pins), POWER_SUPPLY (51 pins), SERVOS (40 pins)
VBAT: IGNITERS (20 pins), POWER_SUPPLY (D20.2 F9.2 J13.2 R61.1), SERVOS (J17.2)
AIN0: MCU (U17.15), SERVOS (C62.1 U11.11)
AIN1: MCU (U17.16), SERVOS (C68.1 U12.11)
AIN2: MCU (U17.1), IGNITERS (R21.2 R22.2)
AIN3: MCU (U17.2), IGNITERS (R31.2 R32.2)
AIN4: MCU (U17.3), IGNITERS (R37.2 R38.2)
AIN5: MCU (U17.4), IGNITERS (R45.2 R46.2)
AIN6: MCU (U17.5), SERVOS (C60.1 U10.11)
AIN7: MCU (U17.6), SERVOS (C59.1 U9.11)
GPIO0: MCU (U1.2), SENSORS (R75.2 U3.8)
GPIO1: MCU (U1.3), SENSORS (R77.2 U7.12)
GPIO2: MCU (U1.4 U17.13), SENSORS (6 pins)
GPIO3: MCU (U1.5 U17.14), SENSORS (6 pins)
GPIO4: MCU (U1.6 U17.12), SENSORS (7 pins)
GPIO5: MCU (U1.7), SENSORS (R79.2 U4.5)
GPIO6: MCU (U1.8), SENSORS (R80.2 U4.14)
GPIO7: MCU (U1.9), SENSORS (R74.2 U5.18)
GPIO8: MCU (U1.11), SENSORS (R76.2 U8.4 U8.5)
GPIO9: MCU (U1.12), SENSORS (R78.2 U6.4)
GPIO11: MCU (U1.14), IGNITERS (R41.1)
GPIO12: MCU (U1.15), IGNITERS (R33.1)
GPIO13: MCU (U1.16), IGNITERS (R25.1)
GPIO14: MCU (U1.17), IGNITERS (R18.1)
GPIO15: MCU (U1.18), SERVOS (R55.1)
GPIO16: MCU (U1.27), IO (R3.1 R5.1 R11.1)
GPIO17: MCU (U1.28), IO (R4.1 R12.1)
GPIO18: MCU (U1.29), SERVOS (R58.1)
GPIO19: MCU (U1.30), SERVOS (S4.5)
GPIO20: MCU (U1.31), SERVOS (S3.5)
GPIO21: MCU (U1.32), IO (R16.1)
GPIO22: MCU (U1.34), SERVOS (S2.5)
GPIO23: MCU (U1.35), SERVOS (R52.1)
GPIO24: MCU (U1.36), SERVOS (S1.5)
GPIO25: MCU (U1.37), SERVOS (R49.1)
GPIO26: MCU (U1.38), POWER_SUPPLY (R63.1)
GPIO27: MCU (U1.39), POWER_SUPPLY (S7.5)
GPIO28: MCU (U1.40), POWER_SUPPLY (S6.5)
GPIO29: MCU (U1.41), POWER_SUPPLY (S5.5)
NetR1_2: MCU (R1.2), POWER_SUPPLY (U15.4)
NetR2_2: MCU (R2.2), POWER_SUPPLY (U15.6)